# EAGLE design board_stm32 (EAGLE 9.6.2)
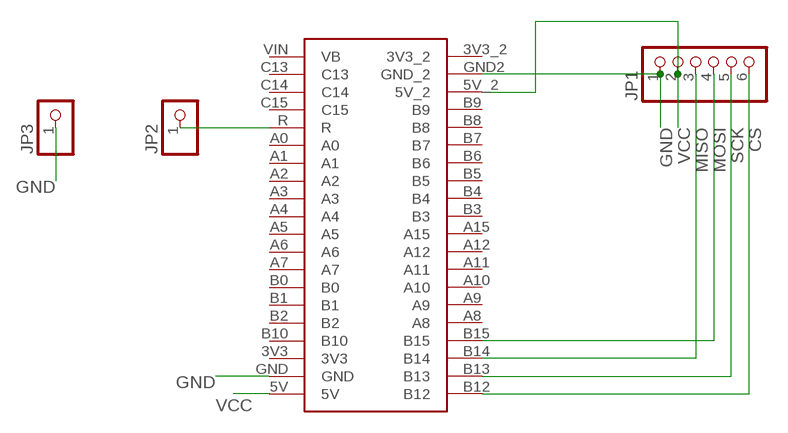
[diagram p0: schematic, sheet 1]

## Parts
JP1  PINHD-1X6  [1X06]
JP2  PINHD-1X1  [1X01]
JP3  PINHD-1X1  [1X01]
U$1  STM32F411CEU6  [STM32F411CEU6]

## Nets
CS: JP1.6 U$1.B12
GND: JP1.1 JP3.1 U$1.GND U$1.GND2(GND_2)
MISO: JP1.3 U$1.B14
MOSI: JP1.4 U$1.B15
N$1: JP2.1 U$1.R
SCK: JP1.5 U$1.B13
VCC: JP1.2 U$1.5V U$1.5V_2
Unconnected: U$1.3V3 U$1.3V3_2 U$1.A0 U$1.A1 U$1.A2 U$1.A3 U$1.A4 U$1.A5 U$1.A6 U$1.A7 U$1.A8 U$1.A9 U$1.A10 U$1.A11 U$1.A12 U$1.A15 U$1.B0 U$1.B1 U$1.B2 U$1.B3 U$1.B4 U$1.B5 U$1.B6 U$1.B7 U$1.B8 U$1.B9 U$1.B10 U$1.C13 U$1.C14 U$1.C15 U$1.VIN(VB)

## Library data of the parts
JP1 = adafruit:PINHD-1X6: PIN HEADER
JP2 JP3 = adafruit:PINHD-1X1: Pin header 1x1 for 0.1" spacing With round pins
U$1 = STM32F411CEU6:STM32F411CEU6

## Board
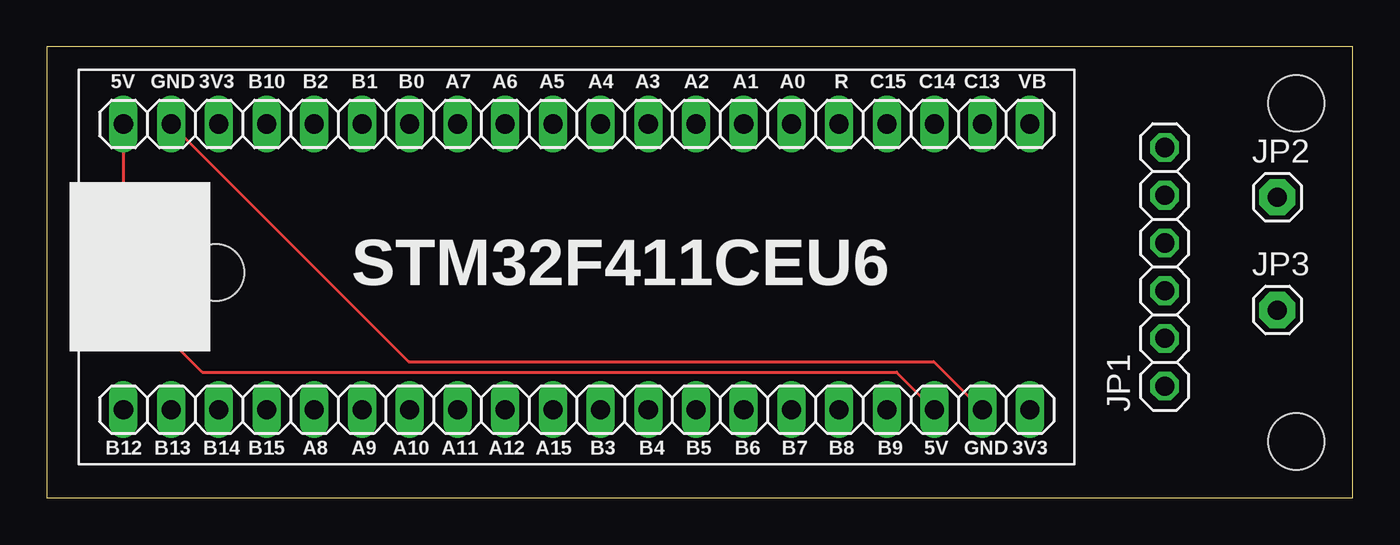
[diagram p1: board, top side]
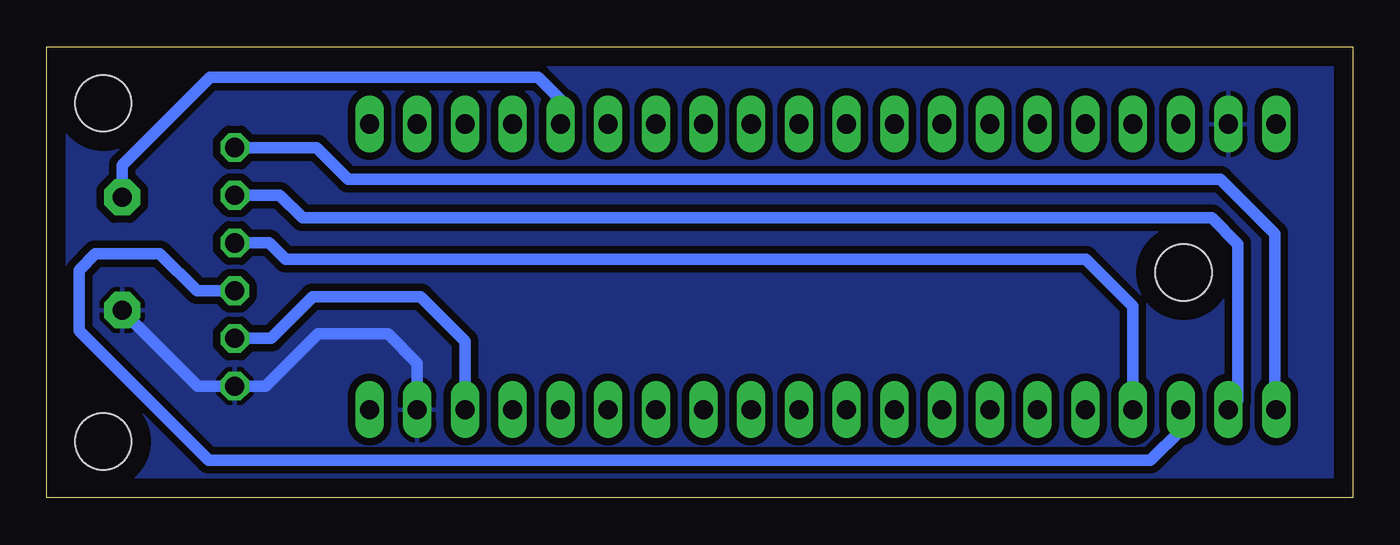
[diagram p2: board, bottom side, seen from below]

Size 69.5 x 24 mm. Coordinates in mm from the lower left corner, seen from the top.
Outline: 0,0 69.5,0 69.5,24 0,24 0,0
Copper layers (1*16): Top 0.035mm / dielectric 1.5mm / Bottom 0.035mm
Design rules "default *": minimum track width 6mil, minimum drill 0.35mm, track to track 0.4mm, track to pad 0.4mm, pad to pad 0.4mm, via to via 0.4mm, smd to smd 0.4mm, copper to edge 40mil, drill to drill 6mil, minimum pad ring 10mil, minimum via ring 8mil, stop-mask expansion 4mil, vias tented up to drill 0mil, thermal gap 10mil
Holes 3 mm at 66.5,21 66.5,3 9,12

### Footprints (pad centres in the part's own frame; a part is rotated, then mirrored left to right if it is on the bottom)
1X06 = drill 1.016 octagon: 1 -6.35,0; 2 -3.81,0; 3 -1.27,0; 4 1.27,0; 5 3.81,0; 6 6.35,0
1X01 = drill 1.016 pad 1.93 octagon: 1 0,0
STM32F411CEU6 = drill 1.016 long: 3V3 7.45,18.1; 3V3_2 50.63,2.9; 5V 2.37,18.1; 5V_2 45.55,2.9; A0 37.93,18.1; A1 35.39,18.1; A2 32.85,18.1; A3 30.31,18.1; A4 27.77,18.1; A5 25.23,18.1; A6 22.69,18.1; A7 20.15,18.1; A8 12.53,2.9; A9 15.07,2.9; A10 17.61,2.9; A11 20.15,2.9; A12 22.69,2.9; A15 25.23,2.9; B0 17.61,18.1; B1 15.07,18.1; B2 12.53,18.1; B3 27.77,2.9; B4 30.31,2.9; B5 32.85,2.9; B6 35.39,2.9; B7 37.93,2.9; B8 40.47,2.9; B9 43.01,2.9; B10 9.99,18.1; B12 2.37,2.9; B13 4.91,2.9; B14 7.45,2.9; B15 9.99,2.9; C13 48.09,18.1; C14 45.55,18.1; C15 43.01,18.1; GND 4.91,18.1; GND2 48.09,2.9; R 40.47,18.1; VIN 50.63,18.1

### Placement (x,y rotation side)
JP1  59.5,12.3 90 top
JP2  65.5,16 0 top
JP3  65.5,10 0 top
U$1  1.7,1.8 0 top

### Tracks (layer width: path | path; a pad name or v marks a point on that pad's centre or on a via)
CS
  Bottom 0.61: U$1.B12 4.14,4.77 4.14,14.07 7.04,16.97 53.47,16.97 55.15,18.65 JP1.6
GND
  Top 0.152: U$1.GND 19.26,7.25 47.21,7.25 49.76,4.7 U$1.GND2
  Bottom 0.61: U$1.GND2 49.79,7.18 51.35,8.74 55.07,8.74 57.86,5.95 JP1.1 61.48,5.95 65.5,9.97 JP3.1
  pour Bottom (isolate 0.4): 0,24 69.5,24 69.5,0 0,0
MISO
  Bottom 0.61: JP1.3 59.52,11.02 61.52,11.02 63.5,13 66.92,13 67.79,12.13 67.79,8.91 60.88,2 10.76,2 9.15,3.61 U$1.B14
MOSI
  Bottom 0.61: U$1.B15 11.69,10.19 14.2,12.7 56.79,12.7 57.66,13.57 JP1.4
N$1
  Bottom 0.61: U$1.R 42.17,21.2 43.36,22.39 60.81,22.39 65.5,17.7 JP2.1
SCK
  Bottom 0.61: JP1.5 57.1,16.11 55.89,14.9 7.5,14.9 6.11,13.51 6.11,5.2 U$1.B13
VCC
  Top 0.152: U$1.5V 4.07,10.9 8.27,6.7 45.22,6.7 47.22,4.7 U$1.5V_2
  Bottom 0.61: U$1.5V_2 47.25,8.34 49.61,10.7 55.35,10.7 57.56,8.49 JP1.2